# Altium schematic sheet Final circuit.SchDoc
size A3; SheetNumber: 2; SheetTotal: 2
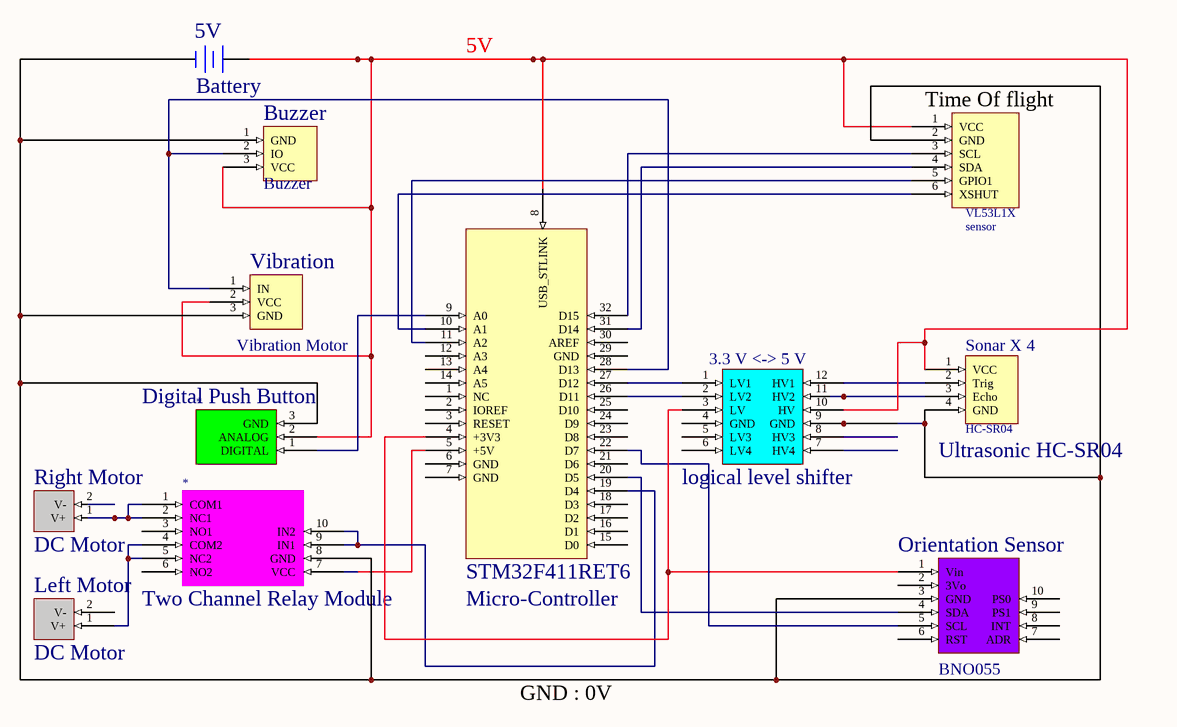
[diagram p0: Final circuit.SchDoc]

## Parts
(Parts that share a designator on the sheet are numbered #1, #2 ... from top to bottom, then left to right.)
3.3_V_<->_5_V  logical level shifter
5V  Battery  [BAT-2]
*#1  Digital Push Button
*#2  Two Channel Relay Module
Buzzer  Buzzer
Left_Motor  DC Motor
Orientation_Sensor  BNO055
Right_Motor  DC Motor
Sonar_X_4  Ultrasonic HC-SR04
STM32F411RET6  Micro-Controller
Time_Of_flight  sensor
Vibration  Vibration Motor

## Nets
5V: 3.3_V_<->_5_V.10(HV) 5V.1(+) *#1.2(ANALOG) Buzzer.3(VCC) Sonar_X_4.1(VCC) STM32F411RET6.8(USB_STLINK) Time_Of_flight.1(VCC) Vibration.2(VCC)
Net3.3_V_<->_5_V_1: 3.3_V_<->_5_V.1(LV1) STM32F411RET6.27(D12)
Net3.3_V_<->_5_V_2: 3.3_V_<->_5_V.2(LV2) STM32F411RET6.26(D11)
Net3.3_V_<->_5_V_3: 3.3_V_<->_5_V.3(LV) Orientation_Sensor.1(Vin) STM32F411RET6.4(+3V3)
Net3.3_V_<->_5_V_9: 3.3_V_<->_5_V.9(GND) 5V.2(-) *#1.3(GND) *#2.8(GND) Buzzer.1(GND) Orientation_Sensor.3(GND) Sonar_X_4.4(GND) Time_Of_flight.2(GND) Vibration.3(GND)
Net3.3_V_<->_5_V_11: 3.3_V_<->_5_V.11(HV2) Sonar_X_4.3(Echo)
Net3.3_V_<->_5_V_12: 3.3_V_<->_5_V.12(HV1) Sonar_X_4.2(Trig)
Net*#1_1: *#1.1(DIGITAL) STM32F411RET6.9(A0)
Net*#2_1: *#2.1(COM1) *#2.2(NC1) Right_Motor.1(V+)
Net*#2_4: *#2.4(COM2) *#2.5(NC2) Left_Motor.1(V+)
Net*#2_7: *#2.7(VCC) STM32F411RET6.5(+5V)
Net*#2_9: *#2.9(IN1) *#2.10(IN2) STM32F411RET6.19(D4)
NetBuzzer_2: Buzzer.2(IO) STM32F411RET6.28(D13) Vibration.1(IN)
NetOrientation_Sensor_4: Orientation_Sensor.4(SDA) STM32F411RET6.20(D5)
NetOrientation_Sensor_5: Orientation_Sensor.5(SCL) STM32F411RET6.22(D7)
NetSTM32F411RET6_10: STM32F411RET6.10(A1) Time_Of_flight.6(XSHUT)
NetSTM32F411RET6_11: STM32F411RET6.11(A2) Time_Of_flight.5(GPIO1)
NetSTM32F411RET6_31: STM32F411RET6.31(D14) Time_Of_flight.4(SDA)
NetSTM32F411RET6_32: STM32F411RET6.32(D15) Time_Of_flight.3(SCL)

Not connected (* = marked no-connect by the designer): 3.3_V_<->_5_V 4(GND) 5(LV3) 6(LV4) 7(HV4) 8(HV3); *#2 3(NO1) 6(NO2); Left_Motor 2(V-); Orientation_Sensor 2(3Vo) 6(RST) 7(ADR) 8(INT) 9(PS1) 10(PS0); Right_Motor 2(V-); STM32F411RET6 1(NC) 2(IOREF) 3(RESET) 6(GND) 7(GND) 12(A3) 13(A4) 14(A5) 15(D0) 16(D1) 17(D2) 18(D3) 21(D6) 23(D8) 24(D9) 25(D10) 29(GND) 30(AREF)

## Notes on the sheet
- Labels drawn without touching a wire or pin: GND : 0V
- (in symbol Component_1) VL53L1X
- (in symbol Ultrasonic HC-SR04) HC-SR04

## Library data of the parts
5V = Battery: Multicell Battery; Published: 24-Mar-1999; LatestRevisionDate: 17-Jul-2002; LatestRevisionNote: Re-released for DXP Platform.; PackageReference: BAT-2; Publisher: Altium Limited; PackageDescription: Battery; 2 Leads
*#2 Left_Motor Right_Motor Time_Of_flight = Component_1
STM32F411RET6 = STM32F411RET6